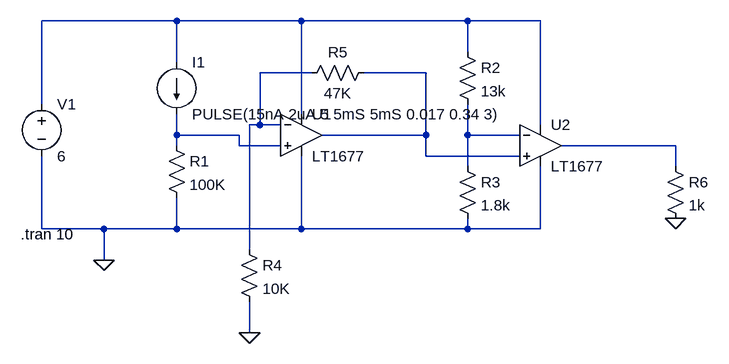
[diagram p0: schematic lightmagic-photo.asc]
lightmagic-photo.asc, the LTspice schematic file:
Version 4
SHEET 1 1124 680
WIRE 240 -32 32 -32
WIRE 432 -32 240 -32
WIRE 688 -32 432 -32
WIRE 800 -32 688 -32
WIRE 688 16 688 -32
WIRE 240 32 240 -32
WIRE 448 48 368 48
WIRE 624 48 528 48
WIRE 32 96 32 -32
WIRE 432 112 432 -32
WIRE 368 128 368 48
WIRE 368 128 352 128
WIRE 400 128 368 128
WIRE 800 128 800 -32
WIRE 240 144 240 112
WIRE 336 144 240 144
WIRE 624 144 624 48
WIRE 624 144 464 144
WIRE 688 144 688 96
WIRE 768 144 688 144
WIRE 240 160 240 144
WIRE 336 160 336 144
WIRE 400 160 336 160
WIRE 1008 160 832 160
WIRE 624 176 624 144
WIRE 768 176 624 176
WIRE 688 192 688 144
WIRE 1008 192 1008 160
WIRE 32 288 32 176
WIRE 128 288 32 288
WIRE 240 288 240 240
WIRE 240 288 128 288
WIRE 432 288 432 176
WIRE 432 288 240 288
WIRE 688 288 688 272
WIRE 688 288 432 288
WIRE 800 288 800 192
WIRE 800 288 688 288
WIRE 352 320 352 128
WIRE 128 336 128 288
WIRE 352 448 352 400
FLAG 128 336 0
FLAG 352 448 0
FLAG 1008 272 0
SYMBOL voltage 32 80 R0
WINDOW 123 0 0 Left 2
WINDOW 39 0 0 Left 2
SYMATTR InstName V1
SYMATTR Value 6
SYMBOL Opamps\\LT1677 432 80 R0
SYMATTR InstName U1
SYMBOL res 224 144 R0
SYMATTR InstName R1
SYMATTR Value 100K
SYMBOL res 336 304 R0
SYMATTR InstName R4
SYMATTR Value 10K
SYMBOL res 544 32 R90
WINDOW 0 0 56 VBottom 2
WINDOW 3 32 56 VTop 2
SYMATTR InstName R5
SYMATTR Value 47K
SYMBOL current 240 32 R0
WINDOW 123 0 0 Left 2
WINDOW 39 0 0 Left 2
SYMATTR InstName I1
SYMATTR Value PULSE(15nA 2uA 5 5mS 5mS 0.017 0.34 3)
SYMBOL Opamps\\LT1677 800 96 R0
SYMATTR InstName U2
SYMBOL res 672 0 R0
SYMATTR InstName R2
SYMATTR Value 13k
SYMBOL res 672 176 R0
SYMATTR InstName R3
SYMATTR Value 1.8k
SYMBOL res 992 176 R0
SYMATTR InstName R6
SYMATTR Value 1k
TEXT 0 296 Left 2 !.tran 10

The netlist it stands for:
* lightmagic-photo.asc
V1 N001 0 6
XU1 N004 N002 N001 0 N003 LT1677  ; pins In+ In- V+ V- OUT
R1 N004 0 100K
R4 N002 0 10K
R5 N003 N002 47K
I1 N001 N004 PULSE(15nA 2uA 5 5mS 5mS 0.017 0.34 3)
XU2 N003 N005 N001 0 N006 LT1677  ; pins In+ In- V+ V- OUT
R2 N001 N005 13k
R3 N005 0 1.8k
R6 N006 0 1k
.tran 10
.lib LTC.lib
.backanno
.end